# Altium schematic sheet fpga-prom.SchDoc: FPGA Program Memory
size A4; Author: GAA; Organization: heig-vd; Address1: heig-vd; Address2: Route de Cheseaux 1; Address3: 1401 Yverdon-les-Bains; Address4: Suisse; DocumentNumber: 5; Revision: 1.1; SheetNumber: 5; SheetTotal: 12
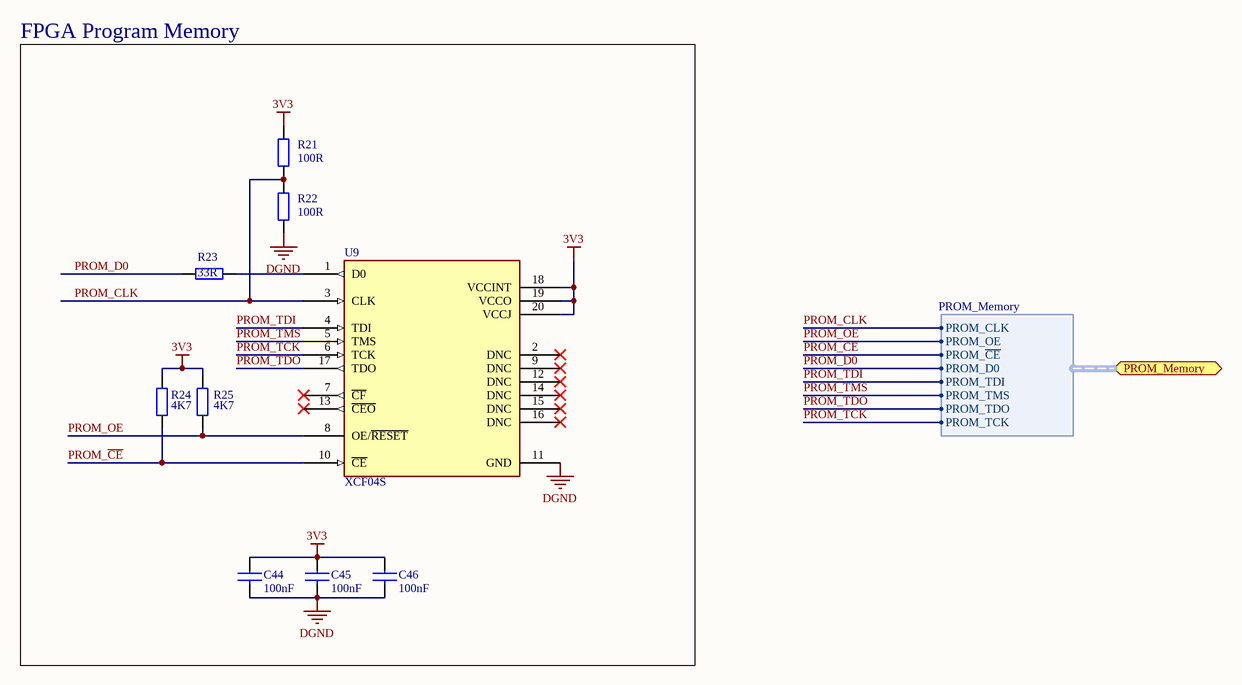
[diagram p0: fpga-prom.SchDoc]

## Parts
C44  100nF  [SM/C_0603]
C45  100nF  [SM/C_0603]
C46  100nF  [SM/C_0603]
R21  100R  [SM/R_0603]
R22  100R  [SM/R_0603]
R23  33R  [SM/R_0603]
R24  4K7  [SM/R_0603]
R25  4K7  [SM/R_0603]
U9  XCF04S  [TSSOP-20]

## Blocks framed on the sheet
FPGA Program Memory: C44-C46 R21-R25 U9

## Ports
PROM_Memory (harness PROM_Memory)

## Harnesses
PROM_Memory: PROM_CLK, PROM_OE, PROM_~{CE}, PROM_D0, PROM_TDI, PROM_TDO, PROM_TCK, PROM_TMS

## Nets
3V3: C44.1 C45.1 C46.1 R21.1 R24.1 R25.1 U9.18(VCCINT) U9.19(VCCO) U9.20(VCCJ)
DGND: C44.2 C45.2 C46.2 R22.2 U9.11(GND)
PROM_~{CE}: R24.2 U9.10(~{CE}) ; port PROM_Memory.PROM_~{CE}
PROM_CLK: R21.2 R22.1 U9.3(CLK) ; port PROM_Memory.PROM_CLK
PROM_D0: R23.1 ; port PROM_Memory.PROM_D0
PROM_OE: R25.2 U9.8(OE/~{RESET}) ; port PROM_Memory.PROM_OE
PROM_TCK: U9.6(TCK) ; port PROM_Memory.PROM_TCK
PROM_TDI: U9.4(TDI) ; port PROM_Memory.PROM_TDI
PROM_TDO: U9.17(TDO) ; port PROM_Memory.PROM_TDO
PROM_TMS: U9.5(TMS) ; port PROM_Memory.PROM_TMS
NetR23_2: R23.2 U9.1(D0)

Not connected (* = marked no-connect by the designer): U9 2(DNC)* 7(~{CF})* 9(DNC)* 12(DNC)* 13(~{CEO})* 14(DNC)* 15(DNC)* 16(DNC)*

## Notes on the sheet
- Route de Cheseaux 1
- CH-1401 Yverdon-les-Bains
- Titre:
- Date:
- Projet:
- Revision:
- Sheet
- of
- File:

## Library data of the parts
C44-C46 = 182: Ceramic multi-layer; Manufacturer: AVX; Manufacturer P/N: 0603YC104KAZ2A; ID: 182; Voltage: 16V; Tolerance: ±10%; Value: 100nF; Component Type: Capacitor, non-polarized; Supplier 1: Farnell; Supplier Part Number 1: 7569556; RoHS Compliant: True
R21 R22 = 85: Résistance 0603 63mW 1% 100R; Manufacturer: Multicomp; Manufacturer P/N: MC 0.036mW 0603 1% 100R; ID: 85; Voltage: 50V; Value: 100R; Component Type: Résistance; Power: 63mW; Tolerance: 1%; Supplier 1: Farnell; Supplier Part Number 1: 9330364; RoHS Compliant: False
R23 = 73: Résistance 0603 63mW 1% 33R; Manufacturer: Multicomp; Manufacturer P/N: MC 0.036mW 0603 1% 33R; ID: 73; Voltage: 50V; Value: 33R; Component Type: Résistance; Power: 63mW; Tolerance: 1%; Supplier 1: Farnell; Supplier Part Number 1: 9331050; RoHS Compliant: False
R24 R25 = 125: Résistance 0603 63mW 1% 4K7; Manufacturer: Multicomp; Manufacturer P/N: MC 0.036mW 0603 1% 4K7; ID: 125; Voltage: 50V; Value: 4K7; Component Type: Résistance; Power: 63mW; Tolerance: 1%; Supplier 1: Farnell; Supplier Part Number 1: 9331247; RoHS Compliant: False
U9 = XCF04S: Platform Flash In-System Programmable Configuration PROMs; Manufacturer: Xilinx; Manufacturer P/N: XCF04SVOG20C; ID: 2190; Pitch: 0,65mm; Value: XCF04SVOG20C; Component Type: IC; Category: Memory; Package Type: TSSOP-20; Supplier 1: Digi-Key; Supplier Part Number 1: 122-1288-5-ND; RoHS Compliant: True; ComponentLink1Description: Datasheet; ComponentLink1URL: http://www.xilinx.com/support/documentation/data_sheets/ds123.pdf; ComponentLink2Description: Supplier; ComponentLink2URL: http://www.digikey.fr/product-search/fr?keywords=122-1288-5-ND